# EAGLE schematic led-driver-v1 (EAGLE 7.5.0)
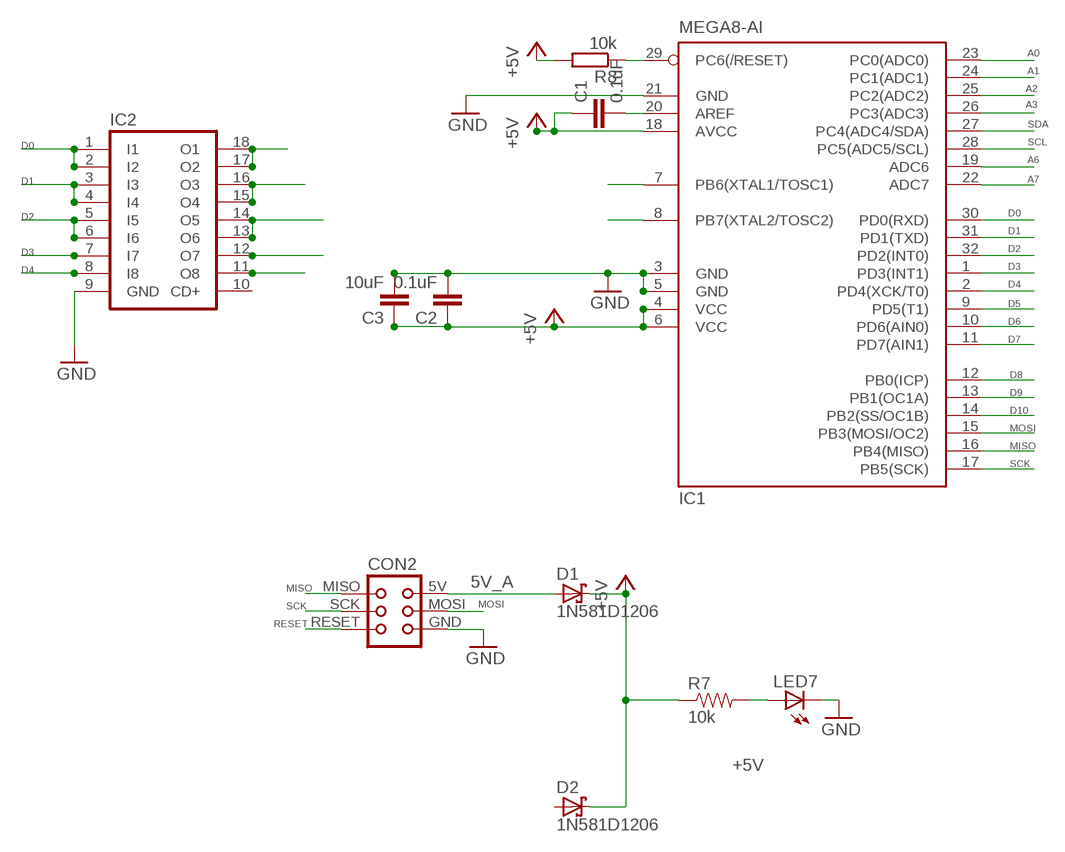
[diagram p0: schematic, sheet 1]

## Parts
C1  0.1uF  C-EUC1206  [C1206]
C2  0.1uF  C-EUC1206  [C1206]
C3  10uF  C-EUC1206  [C1206]
CON2  TINYISPTAG  [TC2030-MCP]
D1  1N581D1206  [LED-1206]
D2  1N581D1206  [LED-1206]
IC1  MEGA8-AI  [TQFP32-08]
IC2  ULN2803A  [SO18W]
LED7  LEDCHIP-LED0603  [CHIP-LED0603]
R7  10k  RESISTOR0603-RES  [0603-RES]
R8  10k  R-EU_M1206  [M1206]

## Nets
5V_A [i2c]: CON2.5V(VCC) D1.A
+5V [power]: C1.1 C2.1 C3.1 D1.C D2.C IC1.4(VCC) IC1.6(VCC) IC1.18(AVCC) R7.1 R8.2
A0: IC1.23(PC0(ADC0))
A1: IC1.24(PC1(ADC1))
A2: IC1.25(PC2(ADC2))
A3: IC1.26(PC3(ADC3))
A6: IC1.19(ADC6)
A7: IC1.22(ADC7)
D0: IC1.30(PD0(RXD)) IC2.1(I1) IC2.2(I2)
D1: IC1.31(PD1(TXD)) IC2.3(I3) IC2.4(I4)
D2: IC1.32(PD2(INT0)) IC2.5(I5) IC2.6(I6)
D3: IC1.1(PD3(INT1)) IC2.7(I7)
D4: IC1.2(PD4(XCK/T0)) IC2.8(I8)
D5: IC1.9(PD5(T1))
D6: IC1.10(PD6(AIN0))
D7: IC1.11(PD7(AIN1))
D8: IC1.12(PB0(ICP))
D9: IC1.13(PB1(OC1A))
D10: IC1.14(PB2(SS/OC1B))
GND [power]: C2.2 C3.2 CON2.GND IC1.3(GND) IC1.5(GND) IC1.21(GND) IC2.9(GND) LED7.C
MISO: CON2.MISO IC1.16(PB4(MISO))
MOSI: CON2.MOSI IC1.15(PB3(MOSI/OC2))
N$1: IC2.11(O8)
N$3: IC2.17(O2) IC2.18(O1)
N$4: C1.2 IC1.20(AREF)
N$5: IC2.15(O4) IC2.16(O3)
N$6: IC2.13(O6) IC2.14(O5)
N$11: IC2.12(O7)
N$15: LED7.A R7.2
PB6: IC1.7(PB6(XTAL1/TOSC1))
PB7: IC1.8(PB7(XTAL2/TOSC2))
RESET: CON2.RESET IC1.29(PC6(/RESET)) R8.1
SCK: CON2.SCK IC1.17(PB5(SCK))
SCL [i2c]: IC1.28(PC5(ADC5/SCL))
SDA [i2c]: IC1.27(PC4(ADC4/SDA))
Unconnected: D2.A IC2.10(CD+)

## Library data of the parts
C1-C3 = resistor:C-EU: CAPACITOR, European symbol
CON2 = lpatiny:TINYISP: CONNECTOR
D1 D2 = lpatiny:1N581*: 1.0A SCHOTTKY BARRIER RECTIFIER Source: http://www.diodes.com/datasheets/ds23001.pdf
IC1 = atmel:MEGA8: MICROCONTROLLER 8 Kbytes FLASH, 1 kbytes SRAM, 512 bytes EEPROM, USART, 6-channel 10 bit ADC, 2-channel 8 bit ADC Pin compatible with Atmega48, ATMega88, ATMega168 Source: avr.lbr; MPN: ATMEGA8-16AU; OC_FARNELL: 9171371; OC_NEWARK: 73M8863
IC2 = lpatiny:ULN2803A: DRIVER ARRAY
LED7 = adafruit:LED: LED OSRAM: - CHIPLED LG R971, LG N971, LY N971, LG Q971, LY Q971, LO R971, LY R971 LH N974, LH R974 LS Q976, LO Q976, LY Q976 LO Q996 - Hyper CHIPLED LW Q18S LB Q993, LB Q99A, LB R99A - SideLED LS A670, LO A670, LY A670, LG A670, LP A670 LB A673, LV A673, LT A673, LW A673 LH A674 LY A675 LS A676, LA A676, LO A676, LY A676, LW A676 LS A679, LY A679, LG A679 - Hyper Micro SIDELED® LS Y876, LA Y876, LO Y876, LY Y876 LT Y87S - SmartLED LW L88C, LW L88S LB L89C, LB L89S, LG L890 LS L89K, LO L89K, LY L89K LS L896, LA L896, LO L896, LY L896 - TOPLED LS T670, LO T670, LY T670, LG T670, LP T670 LSG T670, LSP T670, LSY T670, LOP T670, LYG T670 LG T671, LOG T671, LSG T671 LB T673, LV T673, LT T673, LW T673 LH T674 LS T676, LA T676, LO T676, LY T676, LB T676, LH T676, LSB T676, LW T676 LB T67C, LV T67C, LT T67C, LS T67K, LO T67K, LY T67K, LW E67C LS E67B, LA E67B, LO E67B, LY E67B, LB E67C, LV E67C, LT E67C LW T67C LS T679, LY T679, LG T679 LS T770, LO T770, LY T770, LG T770, LP T770 LB T773, LV T773, LT T773, LW T773 LH T774 LS E675, LA E675, LY E675, LS T675 LS T776, LA T776, LO T776, LY T776, LB T776 LHGB T686 LT T68C, LB T68C - Hyper Mini TOPLED® LB M676 - Mini TOPLED Santana® LG M470 LS M47K, LO M47K, LY M47K Source: http://www.osram.convergy.de/
R7 = SparkFun:RESISTOR: Resistor Basic schematic elements and footprints for 0603, 1206, and PTH resistors.
R8 = resistor:R-EU_: RESISTOR, European symbol

## Net classes
0 default: width 0.305 mm
1 power: width 0.457 mm
2 i2c: width 0.457 mm
3 fine: width 0.305 mm